# EAGLE design EMS esp32 wifi (EAGLE 9.5.2)
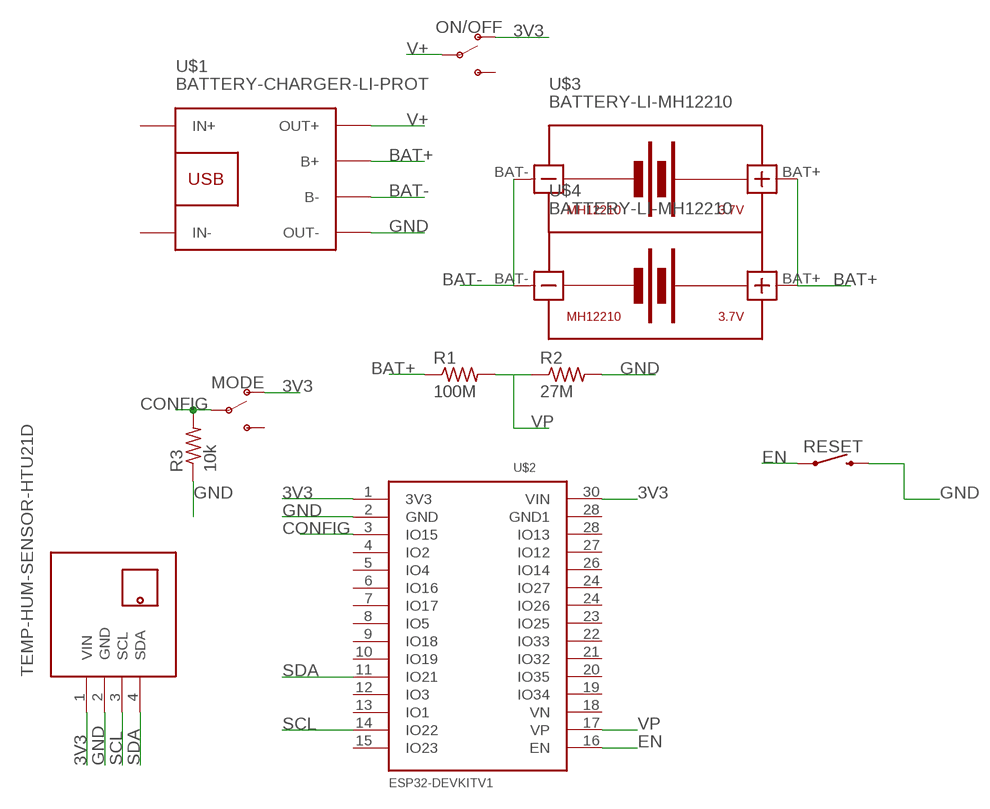
[diagram p0: schematic, sheet 1]

## Parts
MODE  SWITCH-SPDT-PTH-11.6X4.0MM  [SWITCH_SPDT_PTH_11.6X4.0MM]
ON/OFF  SWITCH-SPDT-PTH-11.6X4.0MM  [SWITCH_SPDT_PTH_11.6X4.0MM]
R1  100M  R-US_0204/7  [0204/7]
R2  27M  R-US_0204/7  [0204/7]
R3  10k  R-US_0204/7  [0204/7]
RESET  MOMENTARY-SWITCH-SPST-PTH-6.0MM  [TACTILE_SWITCH_PTH_6.0MM]
U$1  BATTERY-CHARGER-LI-PROT  [BATTERY-CHARGER-LI-PROT]
U$2  ESP32DEVKITV1  [ESP32-DEVKITV1]
U$3  BATTERY-LI-MH12210  [BATTERY-LI-MH12210]
U$4  BATTERY-LI-MH12210  [BATTERY-LI-MH12210]
U$6  TEMP-HUM-SENSOR-HTU21D  [TEMP-HUM-SENSOR-HTU21D]

## Nets
3V3: MODE.1(O) ON/OFF.1(O) U$2.1(3V3) U$2.30(VIN) U$6.1(VIN)
BAT+: R1.1 U$1.B+ U$3.BAT+ U$4.BAT+
BAT-: U$1.B- U$3.BAT- U$4.BAT-
CONFIG: MODE.2(P) R3.2 U$2.3(IO15)
EN: RESET.1 U$2.16(EN)
GND: R2.2 R3.1 RESET.3 U$1.OUT- U$2.2(GND) U$6.2(GND)
SCL: U$2.14(IO22) U$6.3(SCL)
SDA: U$2.11(IO21) U$6.4(SDA)
V+: ON/OFF.2(P) U$1.OUT+
VP: R1.2 R2.1 U$2.17(VP)
Unconnected: MODE.3(S) ON/OFF.3(S) U$1.IN+ U$1.IN- U$2.4(IO2) U$2.5(IO4) U$2.6(IO16) U$2.7(IO17) U$2.8(IO5) U$2.9(IO18) U$2.10(IO19) U$2.12(IO3) U$2.13(IO1) U$2.15(IO23) U$2.18(VN) U$2.19(IO34) U$2.20(IO35) U$2.21(IO32) U$2.22(IO33) U$2.23(IO25) U$2.24(IO26) U$2.24(IO27) U$2.26(IO14) U$2.27(IO12) U$2.28(GND1) U$2.28(IO13)

## Library data of the parts
MODE ON/OFF = SparkFun-Switches:SWITCH-SPDT: Single Pole, Double Throw (SPDT) Switch Single-pole, double-throw (SPDT) switch. Variant Overview SMD-AYZ0202 Surface Mount DPDT Switch <https://www.sparkfun.com/products/597> (COM-00597) Used on e.g. LilyPad Arduino USB - ATmega32U4 Board <https://www.sparkfun.com/products/12049> PTH-11.6X4.0MM SPDT Mini Power Switch <https://www.sparkfun.com/products/102> (COM-00102) Used on e.g. SparkFun Simon Says - Through-Hole Soldering Kit <https://www.sparkfun.com/products/10547> (KIT-10547) PTH-11.6X4.0MM-KIT KIT version of SPDT Mini Power Switch - Simplifies soldering by removing tStop of switch pins - only one side can be soldered. PTH-11.6X4.0MM-LOCK LOCK version of SPDT Mini Power Switch - Offset pins hold switch in place for easier soldering. SMD-RIGHT-ANGLE Surface Mount Right Angle Switch <https://www.sparkfun.com/products/10860> (COM-10860) Used on e.g. SparkFun ESP8266 Thing <https://www.sparkfun.com/products/13231>; PROD_ID: SWCH-08261; SF_SKU: COM-00102
R1-R3 = rcl:R-US_: RESISTOR, American symbol; SPICEPREFIX: R
RESET = SparkFun-Switches:MOMENTARY-SWITCH-SPST: Momentary Switch (Pushbutton) - SPST Normally-open (NO) SPST momentary switches (buttons, pushbuttons). Variants PTH-12MM - 12mm square, through-hole Momentary Pushbutton Switch - 12mm Square <https://www.sparkfun.com/products/9190> (COM-09190) PTH-6.0MM, PTH-6.0MM-KIT - 6.0mm square, through-hole Mini Pushbutton Switch <https://www.sparkfun.com/products/97> (COM-00097) KIT package intended for soldering kit's - only one side of pads' copper is exposed. PTH-RIGHT-ANGLE-KIT - Right-angle, through-hole Right Angle Tactile Button <https://www.sparkfun.com/products/10791> - Used on SparkFun BigTime Watch Kit <https://www.sparkfun.com/products/11734> SMD-12MM - 12mm square, surface-mount Tactile Button - SMD (12mm) <https://www.sparkfun.com/products/12993> (COM-12993) Used on SparkFun PicoBoard <https://www.sparkfun.com/products/11888> SMD-4.5MM - 4.5mm Square Trackball Switch Used on SparkFun Blackberry Trackballer Breakout <https://www.sparkfun.com/products/13169> SMD-4.6MMX2.8MM - 4.60mm x 2.80mm, surface mount Used on SparkFun SAMD21 Mini Breakout <https://www.sparkfun.com/products/13664> SMD-5.2MM, SMD-5.2-REDUNDANT - 5.2mm square, surface-mount Mini Pushbutton Switch - SMD <https://www.sparkfun.com/products/8720> (COM-08720) Used on Arduino Pro Mini <https://www.sparkfun.com/products/11114> REDUNDANT package connects both switch circuits together SMD-6.0X3.5MM - 6.0 x 3.5mm, surface mount Momentary Reset Switch SMD <https://www.sparkfun.com/products/8229> (COM-08229) SMD-6.2MM-TALL - 6.2mm square, surface mount Tactile Button - SMD (6mm) <https://www.sparkfun.com/products/12992> Used on SparkFun Digital Sandbox <https://www.sparkfun.com/products/12651> SMD-RIGHT-ANGLE - Right-angle, surface mount Used on SparkFun Block for Intel® Edison - Arduino <https://www.sparkfun.com/products/13036>; PROD_ID: SWCH-08441; SF_SKU: COM-00097
U$1 = diy-modules:BATTERY-CHARGER-LI-PROT: Lithium Battery 5V Charger with protection circuit More details available here: http://www.instructables.com/id/DIY-Lithium-ion-Battery-Charger/step4/TP4056-based-lithium-ion-battery-charger-module/ Click here to find device on ebay.com <http://www.ebay.com/sch/tp4056+charger+usb+protection>
U$2 = ESP32-DEVKITV1:ESP32DEVKITV1
U$3 U$4 = diy-modules:BATTERY-LI-MH12210: Lithium-Ion MH12210 Rechargeable Battery Panasonic NCR18650PF battery datasheet available here: https://industrial.panasonic.com/cdbs/www-data/pdf2/ACI4000/ACI4000C12.pdf Click here to find device on ebay.com <http://www.ebay.com/sch/ncr18650b+battery>
U$6 = diy-modules:TEMP-HUM-SENSOR-HTU21D: Digital Humidity & Temperature Sensor based on HTU21D device More information about HTU21D device is available here: http://futureeverything.org/wp-content/uploads/2014/05/Humidity-Datasheet.pdf HTU21D Arudino Library is available here: https://learn.sparkfun.com/tutorials/htu21d-humidity-sensor-hookup-guide/htu21d-library-and-functions Click here to find device on ebay.com <http://www.ebay.com/sch/htu21d+board>

## Board
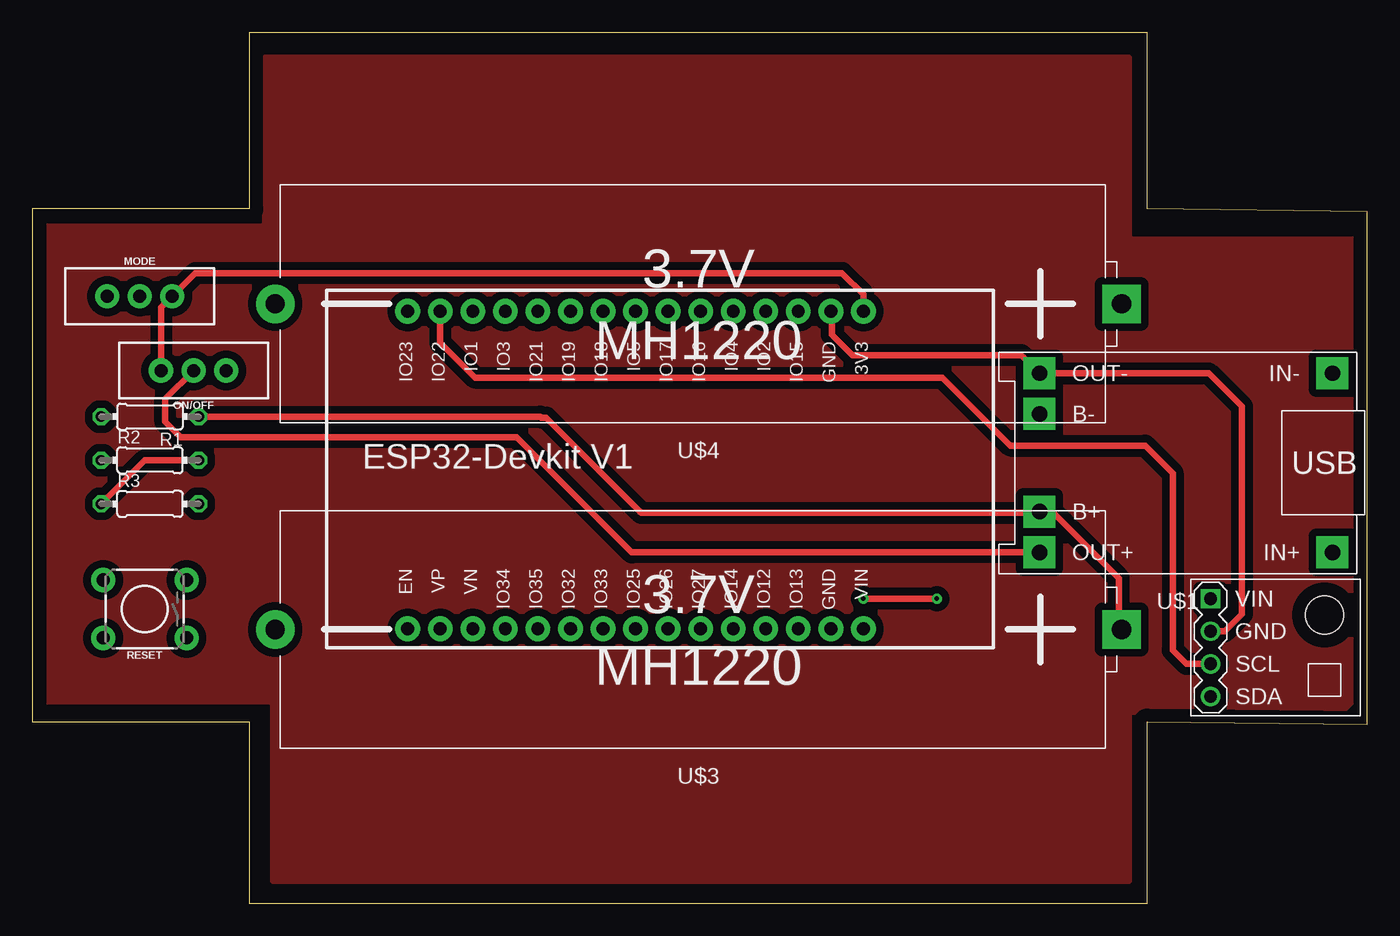
[diagram p1: board, top side]
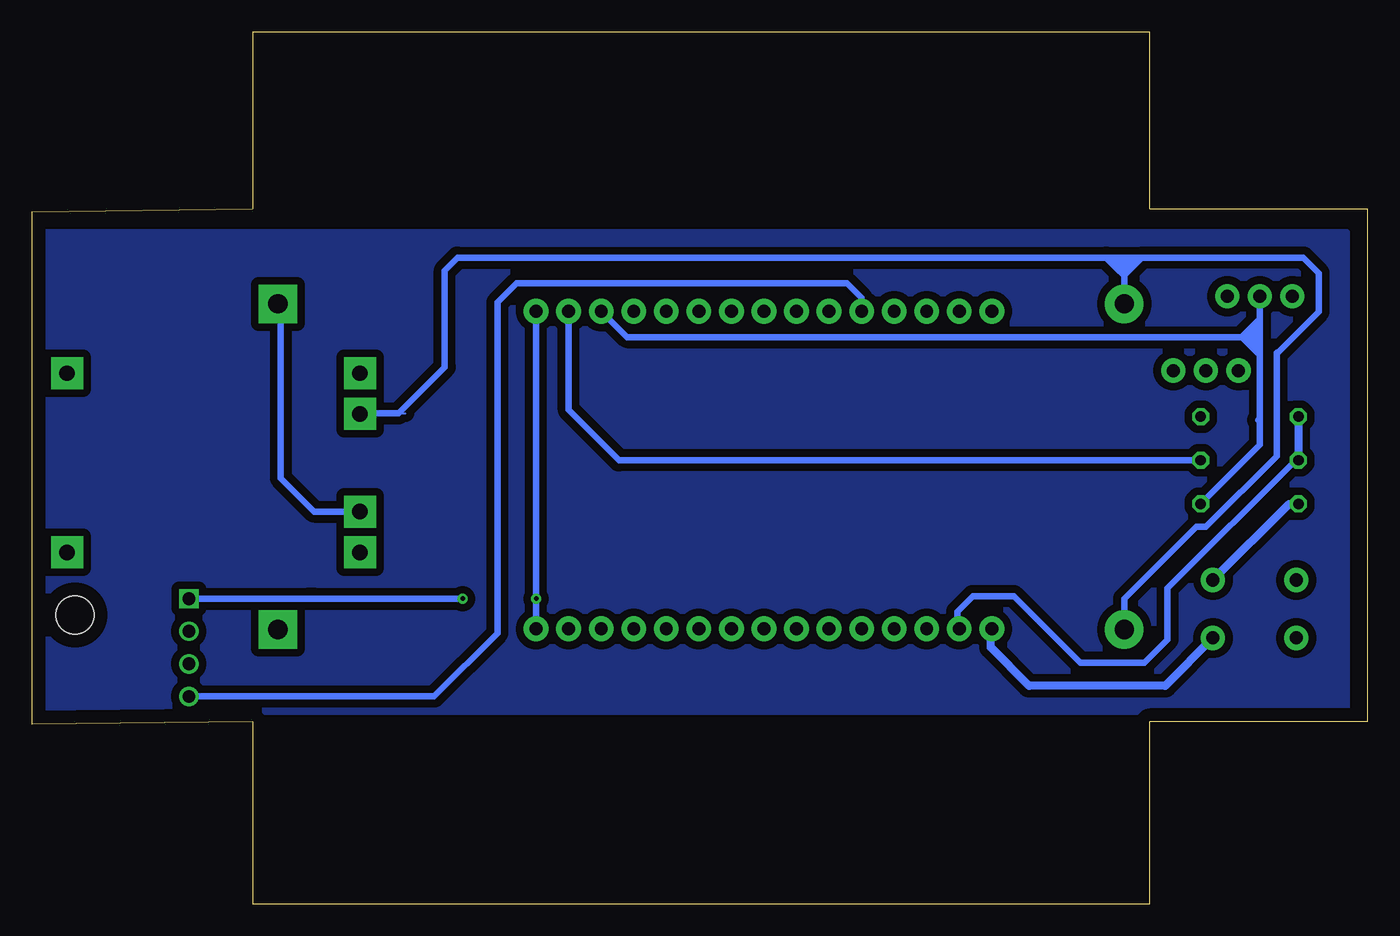
[diagram p2: board, bottom side, seen from below]

Size 104.2 x 68 mm. Coordinates in mm from the lower left corner, seen from the top.
Outline: 17,68 87,68 87,54.2 104.2,54 104.2,14 87,14.2 87,0 17,0 17,14.2 0,14.2 0,54.2 17,54.2 17,68
Copper layers (1*16): Top 0.035mm / dielectric 1.5mm / Bottom 0.035mm
Design rules "default": minimum track width 6mil, minimum drill 0.35mm, track to track 6mil, track to pad 6mil, pad to pad 6mil, via to via 6mil, smd to smd 6mil, copper to edge 40mil, drill to drill 6mil, minimum pad ring 10mil, minimum via ring 8mil, stop-mask expansion 4mil, vias tented up to drill 0mil, thermal gap 10mil

### Footprints (pad centres in the part's own frame; a part is rotated, then mirrored left to right if it is on the bottom)
SWITCH_SPDT_PTH_11.6X4.0MM = drill 1.016 pad 1.88: 1 0,2.54; 2 0,0; 3 0,-2.54
0204/7 = drill 0.813 octagon: 1 -3.81,0; 2 3.81,0
TACTILE_SWITCH_PTH_6.0MM = drill 1.016 pad 1.88: 1 -3.251,2.261; 2 3.251,2.261; 3 -3.251,-2.261; 4 3.251,-2.261
BATTERY-CHARGER-LI-PROT = drill 1.2 pad 2.5 square: B+ 10.795,3.81; B- 10.795,-3.81; IN+ -12.065,6.985; IN- -12.065,-6.985; OUT+ 10.795,6.985; OUT- 10.795,-6.985
ESP32-DEVKITV1 = drill 1 pad 1.93: 1 -22.87,-13.54; 2 -20.33,-13.54; 3 -17.79,-13.54; 4 -15.25,-13.54; 5 -12.71,-13.54; 6 -10.17,-13.54; 7 -7.63,-13.54; 8 -5.09,-13.54; 9 -2.55,-13.54; 10 -0.01,-13.54; 11 2.53,-13.54; 12 5.07,-13.54; 13 7.61,-13.54; 14 10.15,-13.54; 15 12.69,-13.54; 16 12.69,11.23; 17 10.15,11.23; 18 7.61,11.23; 19 5.07,11.23; 20 2.53,11.23; 21 -0.01,11.23; 22 -2.55,11.23; 23 -5.09,11.23; 24 -7.63,11.23; 25 -10.17,11.23; 26 -12.71,11.23; 27 -15.25,11.23; 28 -17.79,11.23; 29 -20.33,11.23; 30 -22.87,11.23
BATTERY-LI-MH12210 = drill 1.5 pad 3 square: BAT+ -33.02,0 | drill 1.5 pad 3: BAT- 33.02,0
TEMP-HUM-SENSOR-HTU21D = drill 1 square: 1 -5.08,3.81 | drill 1: 2 -5.08,1.27; 3 -5.08,-1.27; 4 -5.08,-3.81 | hole 3: 3.81,2.54

### Placement (x,y rotation side)
MODE  8.4,47.4 270 top
ON/OFF  12.6,41.6 90 top
R1  9.2,38 180 top
R2  9.2,34.6 0 top
R3  9.2,31.2 0 top
RESET  8.8,23 180 top
U$1  89.4,34.4 180 top
U$2  42,32.68 180 top
U$3  52,21.4 180 top
U$4  52,46.8 180 top
U$6  97.04,19.99 0 top

### Tracks (layer width: path | path; a pad name or v marks a point on that pad's centre or on a via)
3V3  (via drill 0.35)
  Top 0.508: U$2.1 64.87,47.53 63.2,49.2 12.74,49.2 MODE.1 10.06,46.52 ON/OFF.1 | v70.6,23.8 v64.87,23.8
  Bottom 0.508: U$2.30 v64.87,23.8 U$2.1 | U$6.1 82.6,23.8 82.22,23.8 v70.6,23.8
B
  pour Bottom (isolate 0.61): 1.6,52.4 103.4,52.4 103.4,15 1.6,15
BAT+
  Top 0.152: 39.7,37.95 39.73,37.93 | 47.4,30.64 78.56,30.64 U$1.B+ 78.71,30.49
  Top 0.508: R1.1 39.65,38 39.7,37.95 | 39.73,37.93 40.11,37.93 47.4,30.64 47.55,30.49 78.71,30.49 | U$3.BAT+ 84.8,21.62 84.8,25.4 79.56,30.64 78.56,30.64
  Bottom 0.508: U$4.BAT+ 84.8,46.58 84.8,33.2 82.19,30.59 U$1.B+
BAT-
  Bottom 0.152: 75.6,38.26 75.06,38.26 | 19.12,46.95 U$4.BAT- 18.97,46.95
  Bottom 0.508: U$3.BAT- 18.97,23.8 13.37,29.4 12.6,29.4 7.09,34.91 7.09,43 7,43 3.8,46.2 3.8,49.2 5,50.4 17.6,50.4 | 18.98,49.02 U$4.BAT- | 17.6,50.4 18,50 | 18,50 18.98,49.02 | U$1.B- 78.56,38.26 75.6,38.26 72,41.86 72,49.4 71,50.4 20.4,50.4 | 20.4,50.4 17.6,50.4 | 18.98,49.02 19.02,49.02 19.5,49.5 | 19.5,49.5 19.9,49.9 | 19.9,49.9 20.4,50.4 | 18,50 18.4,50 | 18.4,50 19.8,50 19.9,49.9 | 18.4,50 18.9,49.5 19.5,49.5
CONFIG
  Bottom 0.152: 8.53,37.73 8.46,37.8 8.46,45.2 8.46,45.4 8.46,45.6 8.46,47.25 MODE.2 | 12.88,31.25 R3.2 | 59.05,46.18 59.66,46.18 U$2.3
  Bottom 0.508: MODE.2 8.4,44.2 | 8.4,44.2 8.4,42.8 | 8.4,42.8 8.4,37.86 | 8.4,37.86 8.53,37.73 | 8.4,37.86 8.4,35.81 R3.2 | U$2.3 57.77,44.2 10,44.2 9.86,44.2 | 9.86,44.2 9.66,44.2 | 9.4,44.2 9.66,44.2 | 8.4,44.2 9.4,44.2 | 8.66,45.2 8.46,45.4 | 9.4,44.2 9.4,43.8 | 9.4,43.8 9.13,43.53 | 9.13,43.53 8.9,43.3 | 8.9,43.3 8.4,42.8 | 9.66,44.2 9.66,44.06 9.4,43.8 | 9.66,44.2 9.13,44.73 | 9.13,44.73 8.66,45.2 | 8.66,45.2 8.46,45.2 | 8.66,45.2 8.66,43.54 8.9,43.3 | 9.13,44.73 9.13,43.53 | 9.66,44.2 9.66,44.4 | 9.66,44.4 9.43,44.63 8.46,45.6 | 9.86,44.2 9.66,44.4
EN
  Bottom 0.61: RESET.1 15.79,17 26.4,17 29.4,20 29.4,21.36 U$2.16
GND
  Top 0.152: 62.41,46.18 U$2.2
  Top 0.508: R3.1 8.79,34.6 R2.2 | 62.41,46.18 62.41,44.39 64,42.8 77.19,42.8 U$1.OUT- 91.81,41.38 94.4,38.8 94.4,22.6 93.06,21.26 U$6.2
  Bottom 0.508: R2.2 58.4,34.6 62.33,38.53 U$2.2
  Bottom 0.61: RESET.3 6.11,31.2 R3.1
SCL
  Top 0.152: 91.82,18.75 U$6.3
  Top 0.508: U$2.14 31.85,43.75 34.55,41.05 71.05,41.05 76.35,35.75 86.85,35.75 89,33.6 89,19.8 90.08,18.72 U$6.3
  Bottom 0.152: 31.98,46.16 U$2.14
SDA
  Bottom 0.152: 39.6,46.16 U$2.11
  Bottom 0.508: U$2.11 39.47,47.27 40.6,48.4 66.4,48.4 67.88,46.92 67.88,21.12 72.82,16.18 U$6.4
U
  pour Top (isolate 0.61): 1.2,52.8 18.2,52.8 18.2,66 85.6,66 85.6,51.8 103,51.8 103,15.8 102.2,15 85.6,15 85.6,1.8 18.8,1.8 18.8,15.8 1.2,15.8
V+
  Top 0.508: U$1.OUT+ 46.79,27.41 37.8,36.4 11.6,36.4 10.4,37.6 10.4,39.4 ON/OFF.2
VP
  Top 0.152: 5.41,34.45 R2.1
  Bottom 0.508: R2.1 5.6,34.6 15.6,24.6 15.6,20.6 17.4,18.8 22.4,18.8 27.6,24 30.8,24 32,22.8 32,21.6 U$2.17
  Bottom 0.61: R1.2 R2.1